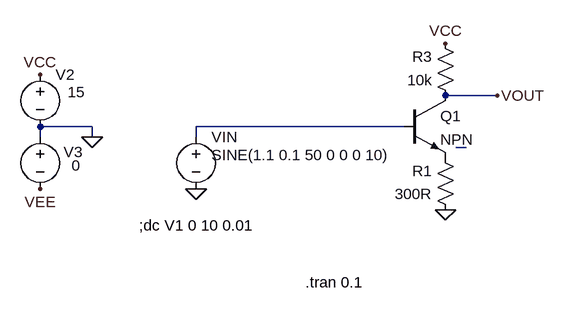
[diagram p0: schematic Draft07.asc]
Draft07.asc, the LTspice schematic file:
Version 4
SHEET 1 880 680
WIRE 432 32 352 32
WIRE -192 80 -272 80
WIRE 288 80 -32 80
WIRE -272 96 -272 80
WIRE -192 96 -192 80
WIRE -32 96 -32 80
WIRE 384 112 368 112
FLAG -32 176 0
FLAG -192 96 0
FLAG 432 32 VOUT
FLAG -272 0 VCC
FLAG 352 -48 VCC
FLAG -272 176 VEE
FLAG 352 208 0
SYMBOL voltage -32 80 R0
WINDOW 123 0 0 Left 0
WINDOW 39 0 0 Left 0
WINDOW 3 24 44 Left 2
SYMATTR Value SINE(1.1 0.1 50 0 0 0 10)
SYMATTR InstName VIN
SYMBOL voltage -272 -16 R0
WINDOW 123 0 0 Left 0
WINDOW 39 0 0 Left 0
WINDOW 3 42 43 Left 2
SYMATTR Value 15
SYMATTR InstName V2
SYMBOL voltage -272 80 R0
WINDOW 123 0 0 Left 0
WINDOW 39 0 0 Left 0
WINDOW 0 36 39 Left 2
WINDOW 3 48 60 Left 2
SYMATTR InstName V3
SYMATTR Value 0
SYMBOL res 368 224 R180
WINDOW 0 36 76 Left 2
WINDOW 3 36 40 Left 2
SYMATTR InstName R1
SYMATTR Value 300R
SYMBOL res 368 48 R180
WINDOW 0 36 76 Left 2
WINDOW 3 36 40 Left 2
SYMATTR InstName R3
SYMATTR Value 10k
SYMBOL npn 288 32 R0
SYMATTR InstName Q1
TEXT -120 232 Left 2 !;dc V1 0 10 0.01
TEXT 136 320 Left 2 !.tran 0.1

The netlist it stands for:
* Draft07.asc
VIN N001 0 SINE(1.1 0.1 50 0 0 0 10)
V2 VCC 0 15
V3 0 VEE 0
R1 0 P001 300R
R3 VOUT VCC 10k
Q1 VOUT N001 P001 0 NPN
.model NPN NPN
.model PNP PNP
.lib standard.bjt
;dc V1 0 10 0.01
.tran 0.1
.backanno
.end